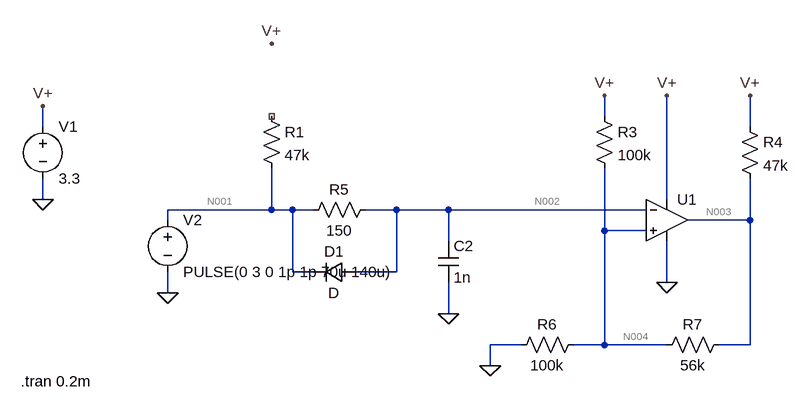
[diagram p0: schematic Draft1.asc]
Draft1.asc, the LTspice schematic file:
Version 4
SHEET 1 900 680
WIRE 528 -32 528 -64
WIRE -336 -16 -336 -48
WIRE 752 -16 752 -64
WIRE -336 96 -336 64
WIRE 624 96 624 -64
WIRE 16 112 16 48
WIRE 16 112 -144 112
WIRE 48 112 16 112
WIRE 80 112 48 112
WIRE 208 112 160 112
WIRE 288 112 208 112
WIRE 592 112 288 112
WIRE -144 128 -144 112
WIRE 752 128 752 64
WIRE 752 128 656 128
WIRE 528 144 528 48
WIRE 592 144 528 144
WIRE 288 160 288 112
WIRE 48 208 48 112
WIRE 80 208 48 208
WIRE 208 208 208 112
WIRE 208 208 144 208
WIRE 624 224 624 160
WIRE -144 240 -144 208
WIRE 288 272 288 224
WIRE 400 320 352 320
WIRE 528 320 528 144
WIRE 528 320 480 320
WIRE 624 320 528 320
WIRE 752 320 752 128
WIRE 752 320 704 320
WIRE 352 352 352 320
FLAG 288 272 0
FLAG 624 224 0
FLAG 624 -64 V+
FLAG -336 -48 V+
FLAG 16 -144 V+
FLAG 528 -64 V+
FLAG 752 -64 V+
FLAG 352 352 0
FLAG -144 240 0
FLAG -336 96 0
SYMBOL res 0 -48 R0
SYMATTR InstName R1
SYMATTR Value 47k
SYMBOL res 512 -48 R0
SYMATTR InstName R3
SYMATTR Value 100k
SYMBOL res 736 -32 R0
SYMATTR InstName R4
SYMATTR Value 47k
SYMBOL voltage -336 -32 R0
WINDOW 123 0 0 Left 0
WINDOW 39 0 0 Left 0
SYMATTR InstName V1
SYMATTR Value 3.3
SYMBOL voltage -144 112 R0
WINDOW 123 0 0 Left 0
WINDOW 39 0 0 Left 0
SYMATTR InstName V2
SYMATTR Value PULSE(0 3 0 1p 1p 70u 140u)
SYMBOL res 176 96 R90
WINDOW 0 0 56 VBottom 2
WINDOW 3 32 56 VTop 2
SYMATTR InstName R5
SYMATTR Value 150
SYMBOL cap 272 160 R0
SYMATTR InstName C2
SYMATTR Value 1n
SYMBOL res 496 304 R90
WINDOW 0 0 56 VBottom 2
WINDOW 3 32 56 VTop 2
SYMATTR InstName R6
SYMATTR Value 100k
SYMBOL res 720 304 R90
WINDOW 0 0 56 VBottom 2
WINDOW 3 32 56 VTop 2
SYMATTR InstName R7
SYMATTR Value 56k
SYMBOL Opamps\\UniversalOpamp2 624 128 R0
SYMATTR InstName U1
SYMBOL diode 144 192 R90
WINDOW 0 0 32 VBottom 2
WINDOW 3 32 32 VTop 2
SYMATTR InstName D1
TEXT -370 376 Left 2 !.tran 0.2m

The netlist it stands for:
* Draft1.asc
R1 NC_01 N001 47k
R3 V+ N004 100k
R4 V+ N003 47k
V1 V+ 0 3.3
V2 N001 0 PULSE(0 3 0 1p 1p 70u 140u)
R5 N002 N001 150
C2 N002 0 1n
R6 N004 0 100k
R7 N003 N004 56k
XU1 N004 N002 V+ 0 N003 level.2 Avol=1Meg GBW=10Meg Slew=10Meg ilimit=25m rail=0 Vos=0 phimargin=45 en=0 enk=0 in=0 ink=0 Rin=500Meg  ; pins IN+ IN- V+ V- OUT
D1 N002 N001 D
.model D D
.lib standard.dio
.tran 0.2m
.lib UniversalOpamps2.sub
.backanno
.end

* Results of the author's LTspice run, read from the files saved beside the schematic
* Operating Point, zero values left out:
*   V(v+) = 3.3 V
*   V(n004) = 2.428 V
*   V(n003) = 3.3 V
*   V(n002) = 495 nV
*   I(R7) = 15.57 µA
*   I(R6) = 24.28 µA
*   I(R5) = 3.3 nA
*   I(R4) = 3.699 nA
*   I(R3) = 8.718 µA
*   I(V2) = 3.3 nA
*   I(V1) = -24.62 µA
*   Ix(u1:1) = 1.556 nA
*   Ix(u1:2) = -3.3 nA
*   Ix(u1:3) = 15.9 µA
*   Ix(u1:4) = -404.2 nA
*   Ix(u1:5) = -15.56 µA
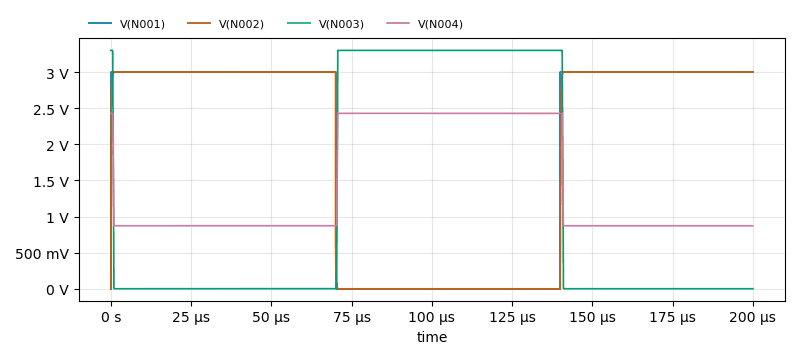
[diagram p1: Transient Analysis of Draft1.asc, plotted from the saved traces]
* Transient Analysis, 1 run:
*   V(N001): min 0 V, max 3 V, average 1.95 V, rms 2.419 V, last 3 V
*   V(N002): min 475.2 nV, max 3 V, average 1.946 V, rms 2.414 V, last 3 V
*   V(N003): min 940.3 µV, max 3.3 V, average 1.172 V, rms 1.964 V, last 940.3 µV
*   V(N004): min 872.2 mV, max 2.428 V, average 1.425 V, rms 1.607 V, last 872.2 mV